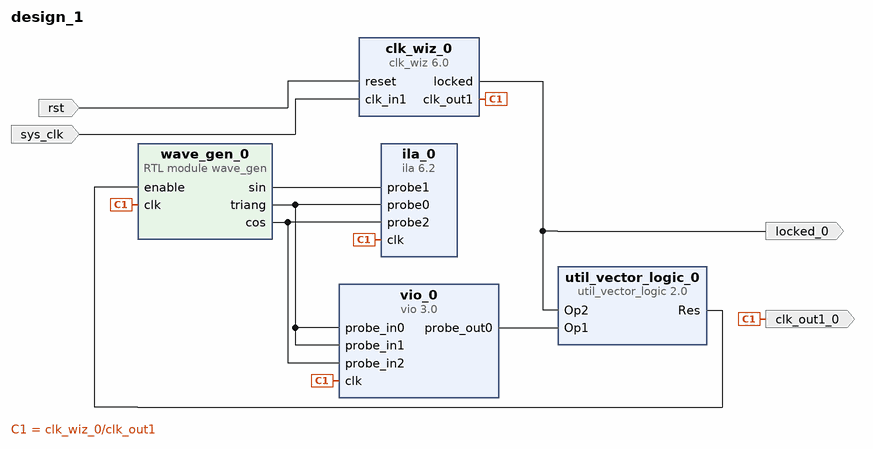
[diagram p0: block diagram of the top level]
# Vivado block design design_1, xc7z010clg400-1, Vivado 2020.1
create_bd_design design_1

create_bd_port -dir I -type rst rst
set_property -dict {CONFIG.POLARITY ACTIVE_HIGH} [get_bd_ports rst]
create_bd_port -dir I -type clk sys_clk
create_bd_port -dir O -type clk clk_out1_0
create_bd_port -dir O locked_0

create_bd_cell -type ip -vlnv xilinx.com:ip:clk_wiz:6.0 clk_wiz_0
create_bd_cell -type ip -vlnv xilinx.com:ip:vio:3.0 vio_0
set_property -dict {CONFIG.C_NUM_PROBE_IN 3 CONFIG.C_PROBE_OUT0_WIDTH 1} [get_bd_cells vio_0]
create_bd_cell -type ip -vlnv xilinx.com:ip:util_vector_logic:2.0 util_vector_logic_0
set_property -dict {CONFIG.C_SIZE 1} [get_bd_cells util_vector_logic_0]
create_bd_cell -type ip -vlnv xilinx.com:ip:ila:6.2 ila_0
set_property -dict {CONFIG.C_ENABLE_ILA_AXI_MON false CONFIG.C_MONITOR_TYPE Native CONFIG.C_NUM_OF_PROBES 3} [get_bd_cells ila_0]
create_bd_cell -type module -reference wave_gen wave_gen_0

# ---- connections ----

connect_bd_net -net reset_0_1 [get_bd_ports rst] [get_bd_pins clk_wiz_0/reset]
connect_bd_net -net clk_in1_0_1 [get_bd_ports sys_clk] [get_bd_pins clk_wiz_0/clk_in1]
connect_bd_net [get_bd_pins clk_wiz_0/clk_out1] [get_bd_ports clk_out1_0] [get_bd_pins wave_gen_0/clk] [get_bd_pins ila_0/clk] [get_bd_pins vio_0/clk]
connect_bd_net [get_bd_pins clk_wiz_0/locked] [get_bd_ports locked_0] [get_bd_pins util_vector_logic_0/Op2]
connect_bd_net [get_bd_pins vio_0/probe_out0] [get_bd_pins util_vector_logic_0/Op1]
connect_bd_net [get_bd_pins util_vector_logic_0/Res] [get_bd_pins wave_gen_0/enable]
connect_bd_net [get_bd_pins wave_gen_0/triang] [get_bd_pins ila_0/probe0] [get_bd_pins vio_0/probe_in0] [get_bd_pins vio_0/probe_in1]
connect_bd_net [get_bd_pins wave_gen_0/sin] [get_bd_pins ila_0/probe1]
connect_bd_net [get_bd_pins wave_gen_0/cos] [get_bd_pins ila_0/probe2] [get_bd_pins vio_0/probe_in2]

validate_bd_design
save_bd_design
